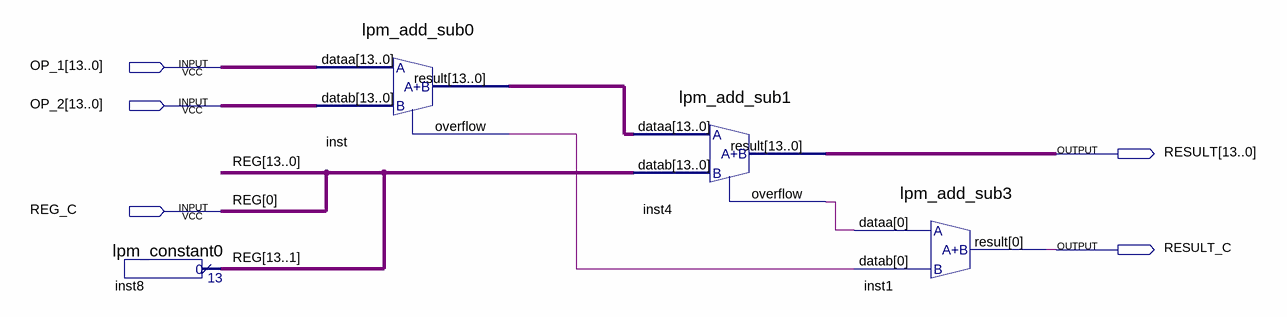
[diagram p0: schematic sheet]
// Quartus schematic OP_ADDC.bdf as structural Verilog: 4 symbols, 5 pins
module OP_ADDC (
  input  [13:0] OP_1,
  input  [13:0] OP_2,
  input  REG_C,
  output [13:0] RESULT,
  output RESULT_C
);

  wire inst4_overflow, inst_overflow;
  wire [13:0] inst_result;
  wire [13:1] REG;

  lpm_constant0 inst8 (.result(REG));
  lpm_add_sub0 inst (.dataa(OP_1), .datab(OP_2), .result(inst_result), .overflow(inst_overflow));
  lpm_add_sub1 inst4 (.dataa(inst_result), .datab({REG, REG_C}), .result(RESULT), .overflow(inst4_overflow));
  lpm_add_sub3 inst1 (.dataa(inst4_overflow), .datab(inst_overflow), .result(RESULT_C));

  // Other names for the same wires on the sheet: REG[0] = REG_C
endmodule
